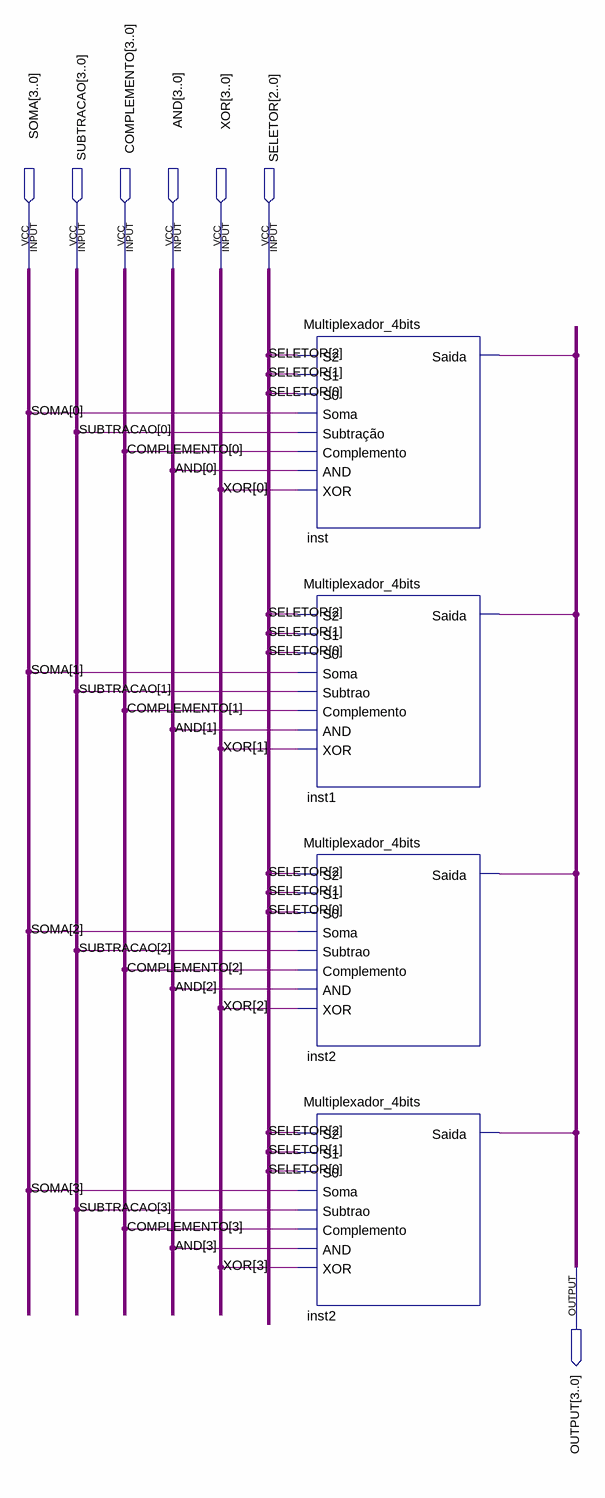
[diagram p0: schematic sheet]
// Quartus schematic Multiplexador_4bits_completo.bdf as structural Verilog: 4 symbols, 7 pins
module Multiplexador_4bits_completo (
  input  [3:0] SOMA,
  input  [3:0] SUBTRACAO,
  input  [3:0] COMPLEMENTO,
  input  [3:0] AND,
  input  [3:0] XOR,
  input  [2:0] SELETOR,
  output [3:0] OUTPUT
);

  wire inst1_saida, inst2_saida, inst2_saida_2, inst_saida;

  Multiplexador_4bits inst (
    .S2(SELETOR[2]), .S1(SELETOR[1]), .S0(SELETOR[0]), .Soma(SOMA[0]), .\Subtração (SUBTRACAO[0]),
    .Complemento(COMPLEMENTO[0]), .AND(AND[0]), .XOR(XOR[0]), .Saida(inst_saida));
  Multiplexador_4bits inst1 (
    .S2(SELETOR[2]), .S1(SELETOR[1]), .S0(SELETOR[0]), .Soma(SOMA[1]), .Subtrao(SUBTRACAO[1]),
    .Complemento(COMPLEMENTO[1]), .AND(AND[1]), .XOR(XOR[1]), .Saida(inst1_saida));
  Multiplexador_4bits inst2 (
    .S2(SELETOR[2]), .S1(SELETOR[1]), .S0(SELETOR[0]), .Soma(SOMA[2]), .Subtrao(SUBTRACAO[2]),
    .Complemento(COMPLEMENTO[2]), .AND(AND[2]), .XOR(XOR[2]), .Saida(inst2_saida));
  Multiplexador_4bits inst2_dup2 (
    .S2(SELETOR[2]), .S1(SELETOR[1]), .S0(SELETOR[0]), .Soma(SOMA[3]), .Subtrao(SUBTRACAO[3]),
    .Complemento(COMPLEMENTO[3]), .AND(AND[3]), .XOR(XOR[3]), .Saida(inst2_saida_2));
endmodule
